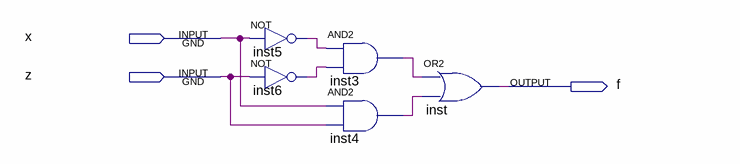
[diagram p0: schematic sheet]
// Quartus schematic 2-2-2-after.bdf as structural Verilog: 5 symbols, 3 pins
module \2-2-2-after  (
  input  x,
  input  z,
  output f
);

  wire inst3_out, inst4_out, inst5_out, inst6_out;

  not inst5 (inst5_out, x);
  not inst6 (inst6_out, z);
  and inst3 (inst3_out, inst5_out, inst6_out);
  and inst4 (inst4_out, x, z);
  or inst (f, inst3_out, inst4_out);
endmodule
